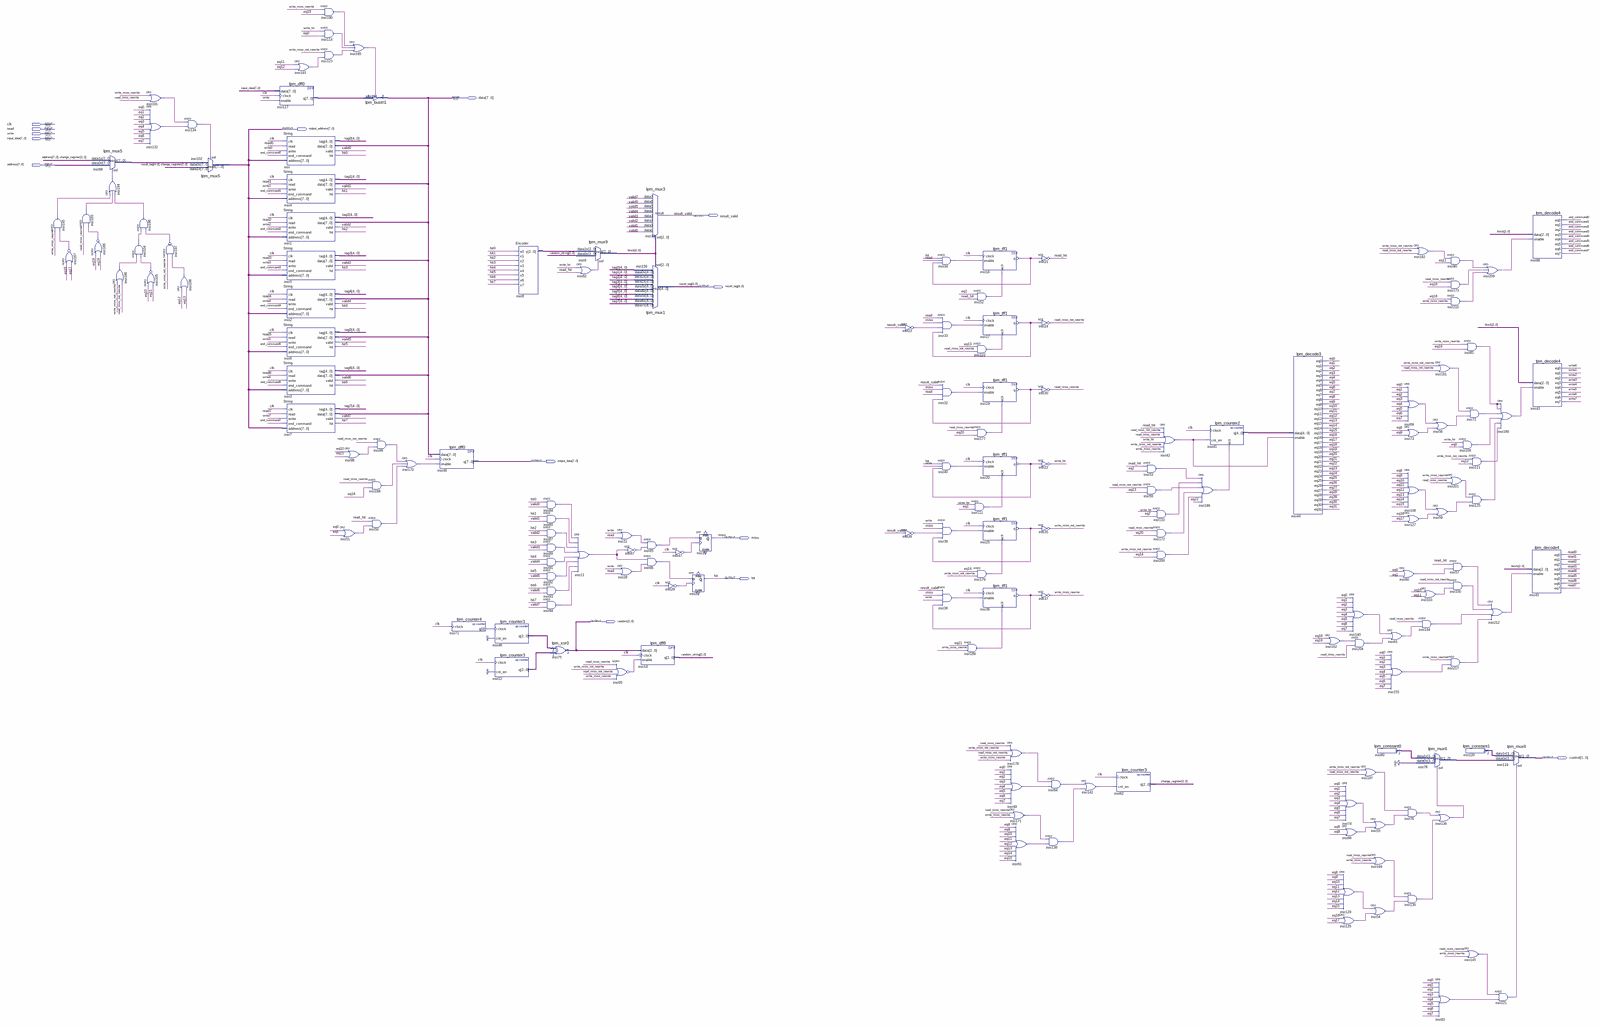
[diagram p0: schematic sheet, whole]
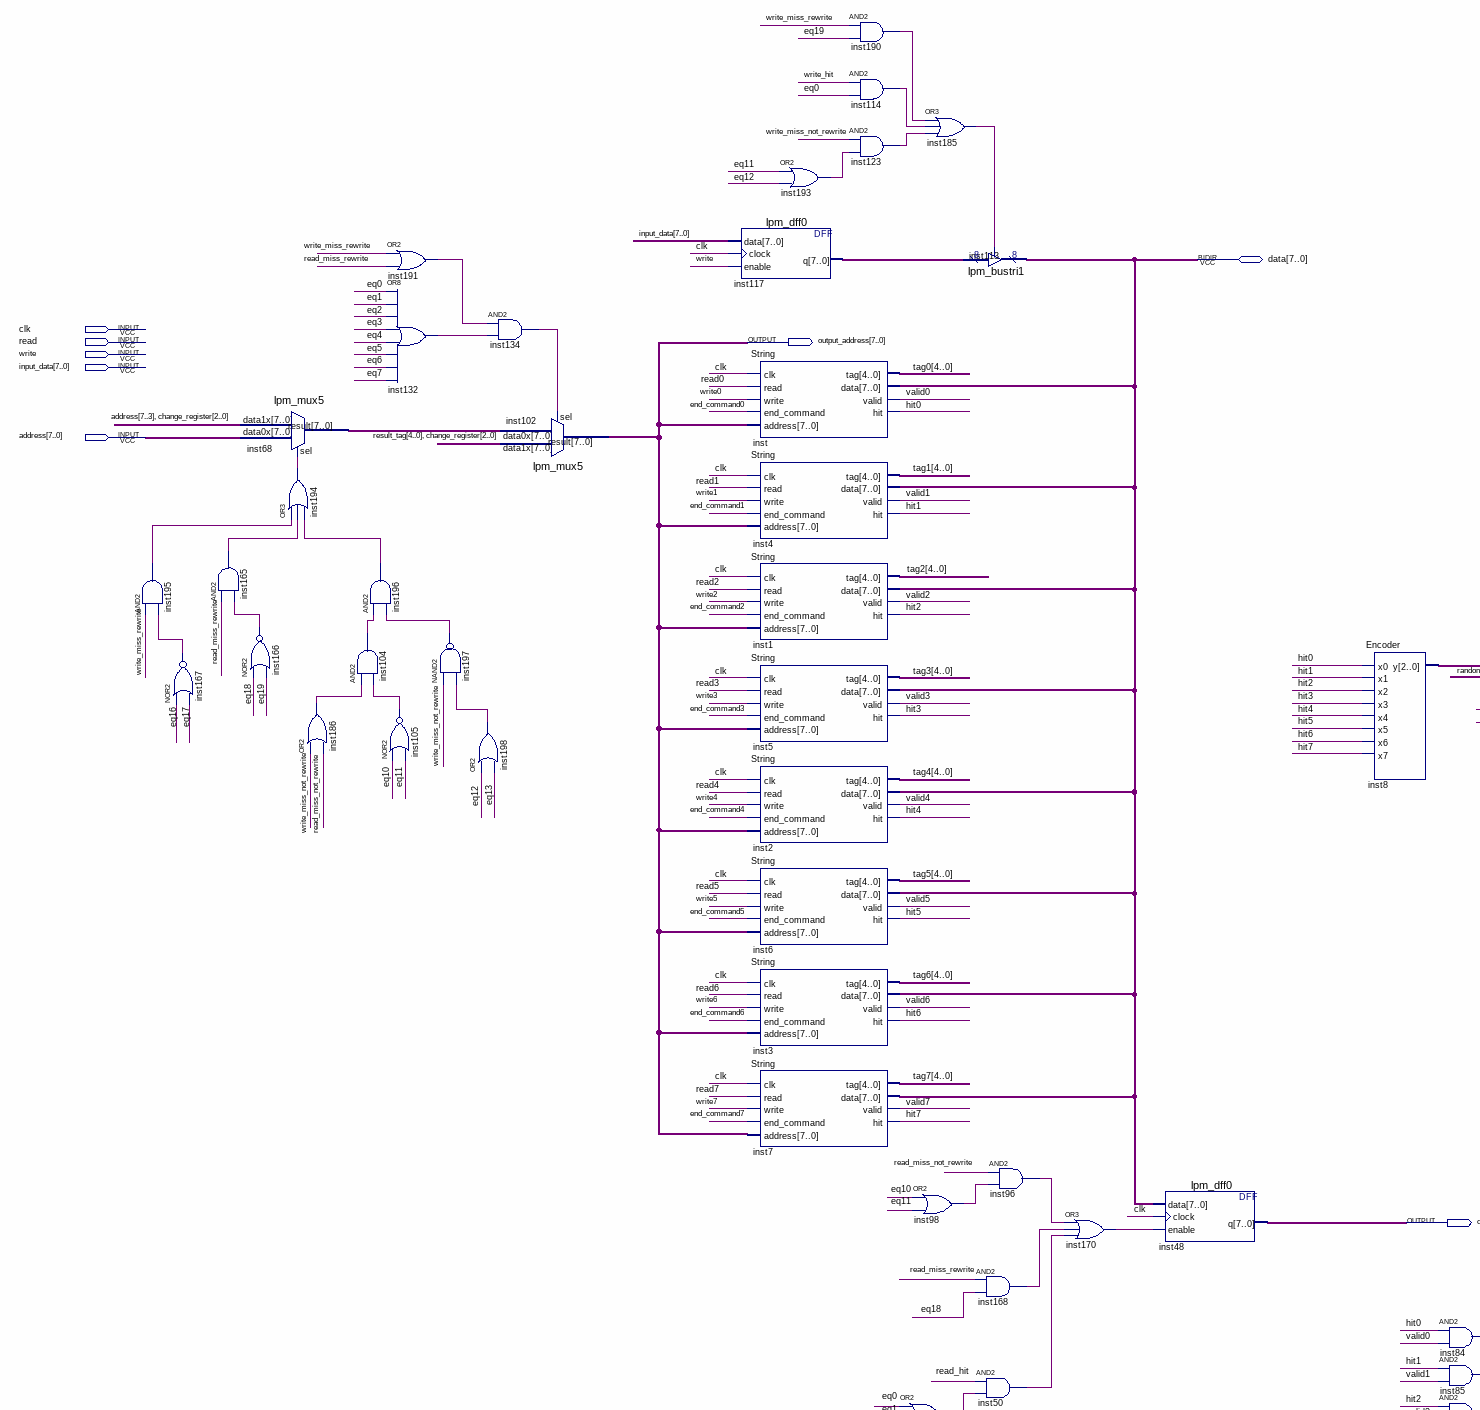
[diagram p1: schematic sheet, upper left part]
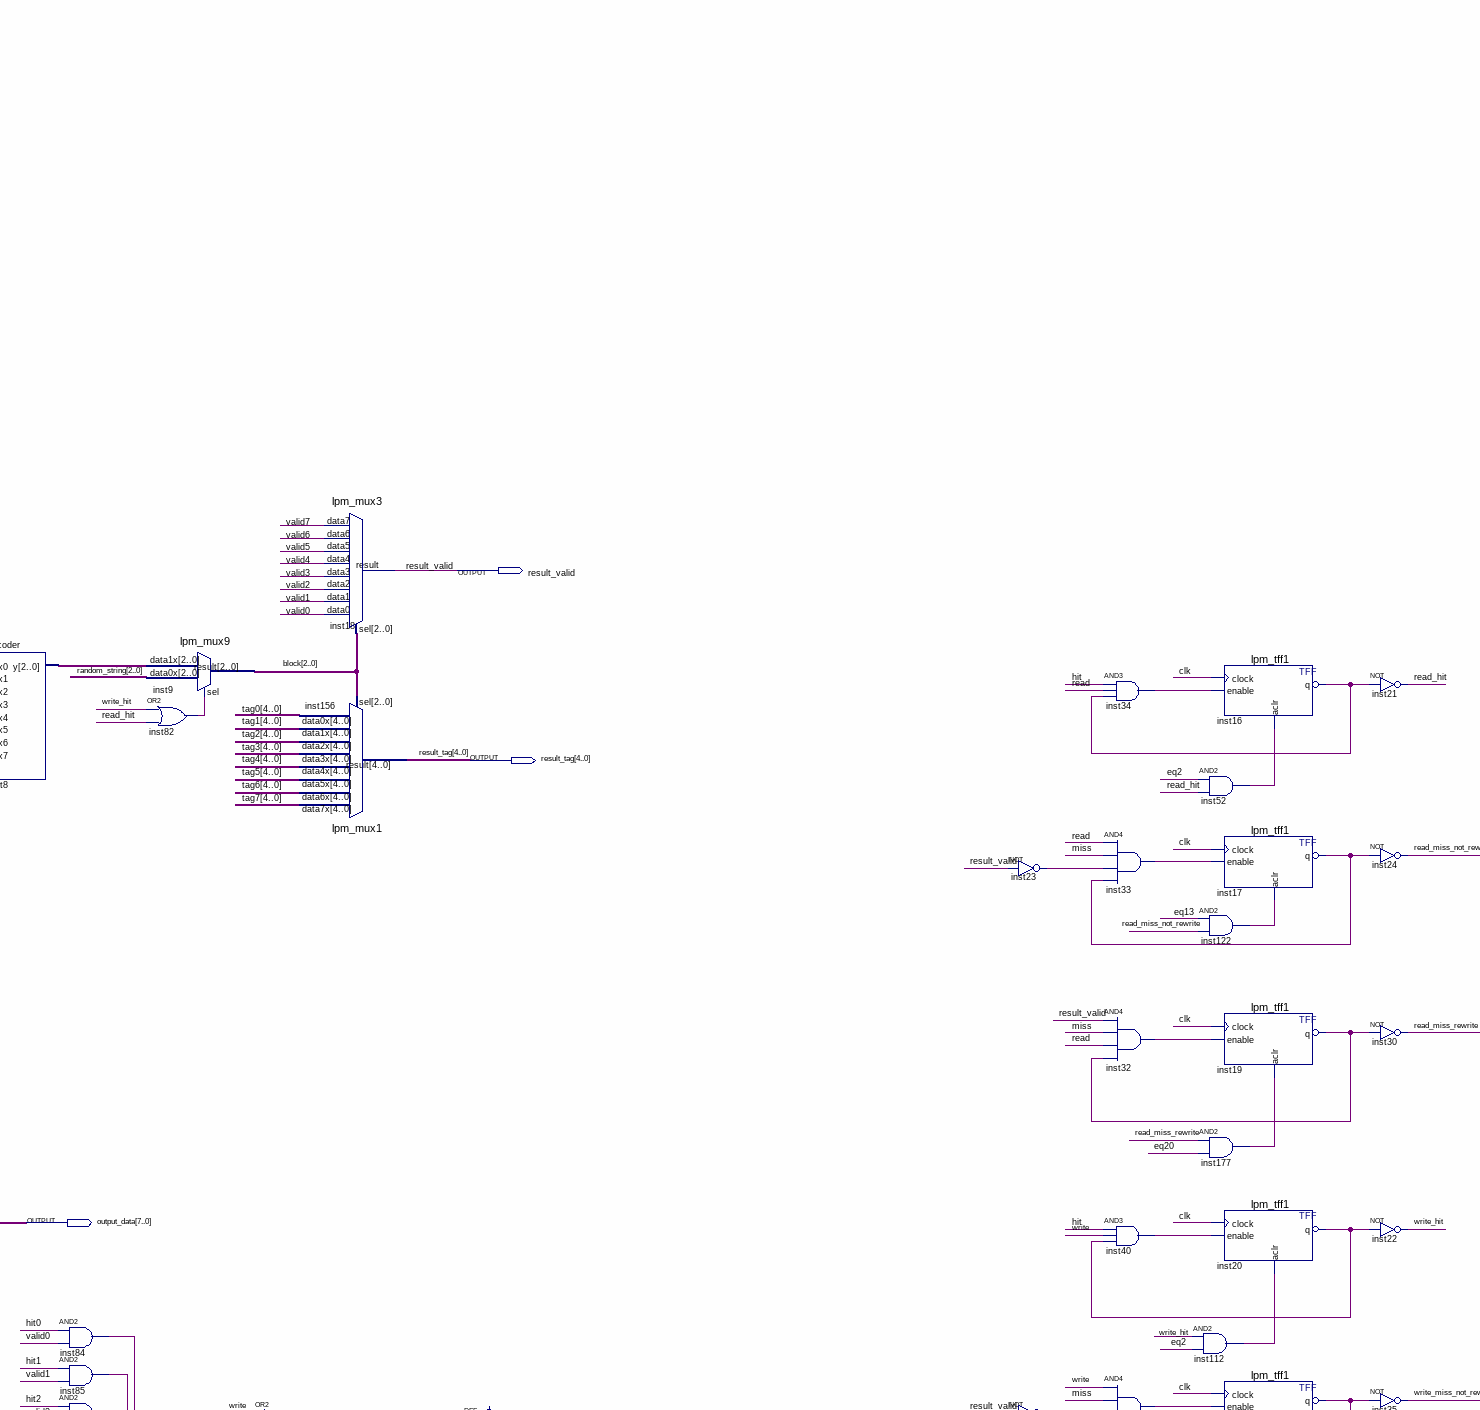
[diagram p2: schematic sheet, upper centre part]
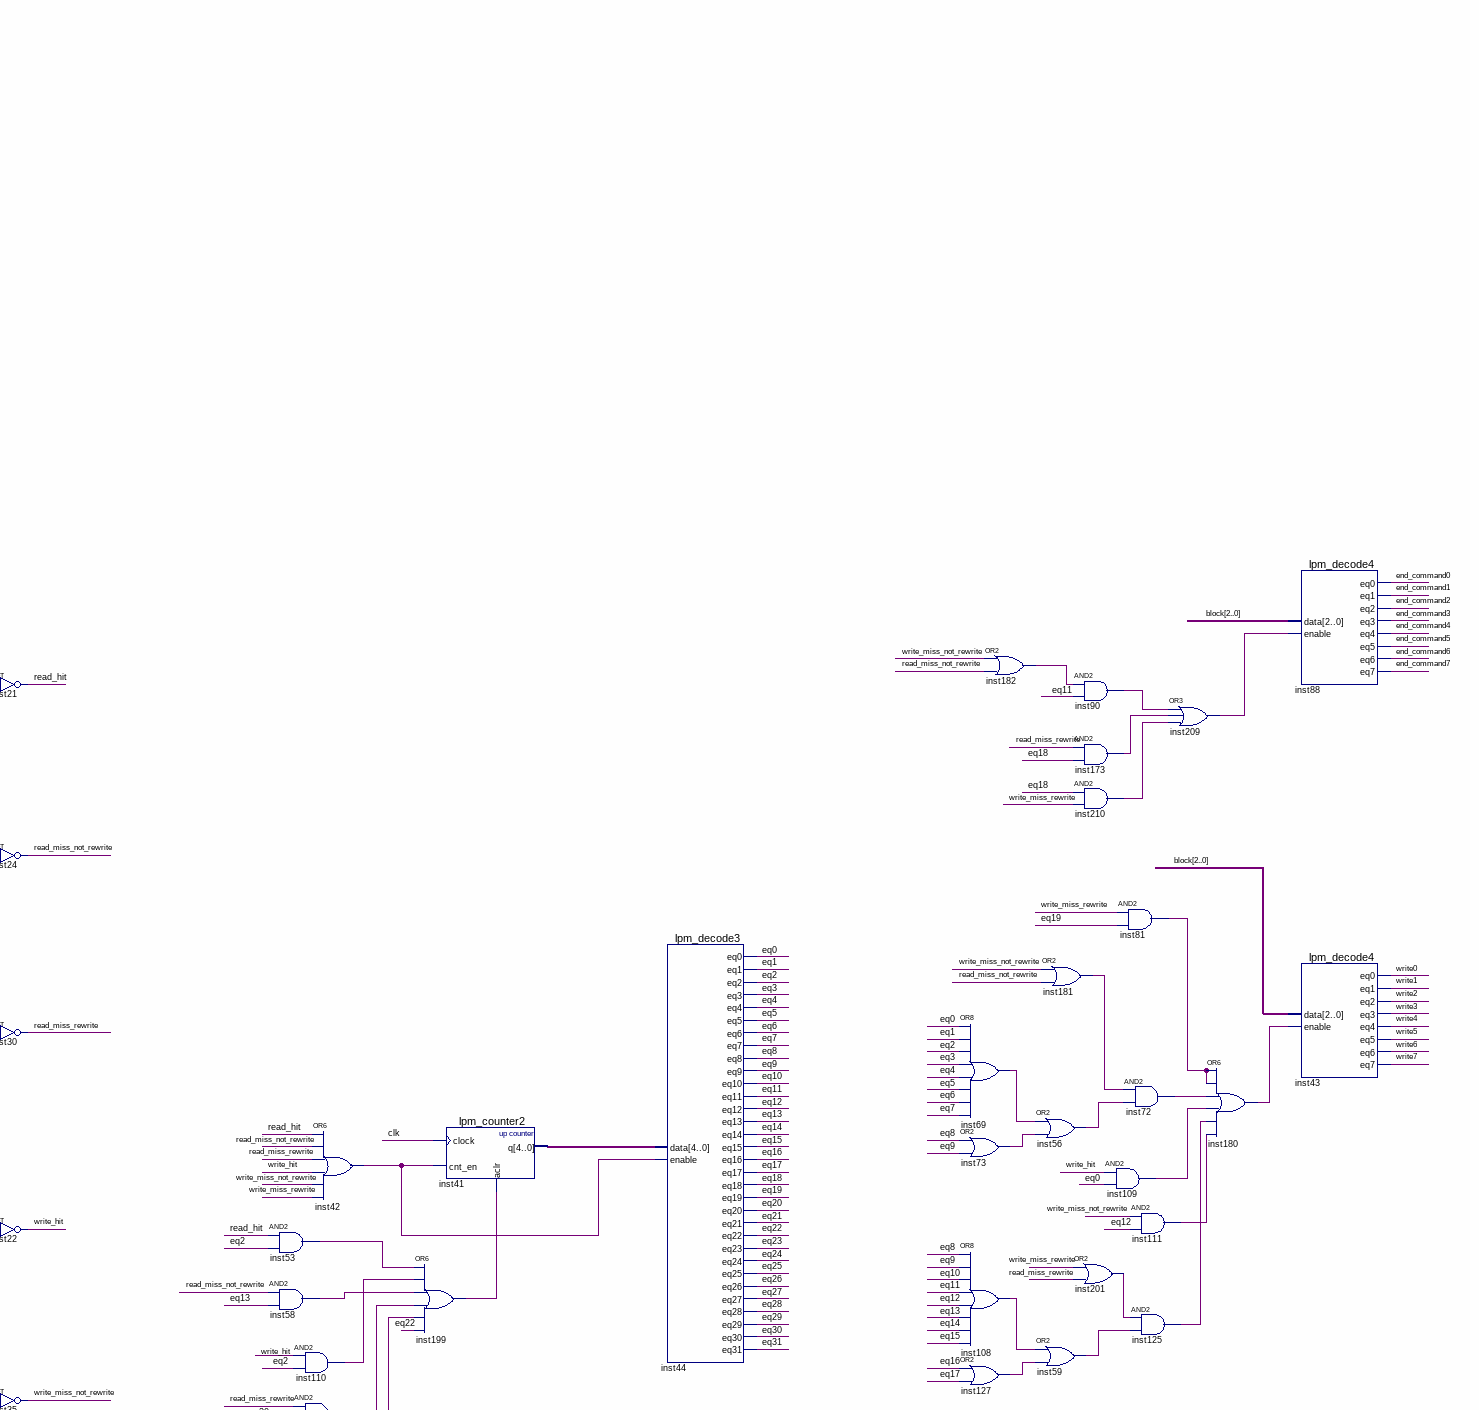
[diagram p3: schematic sheet, upper right part]
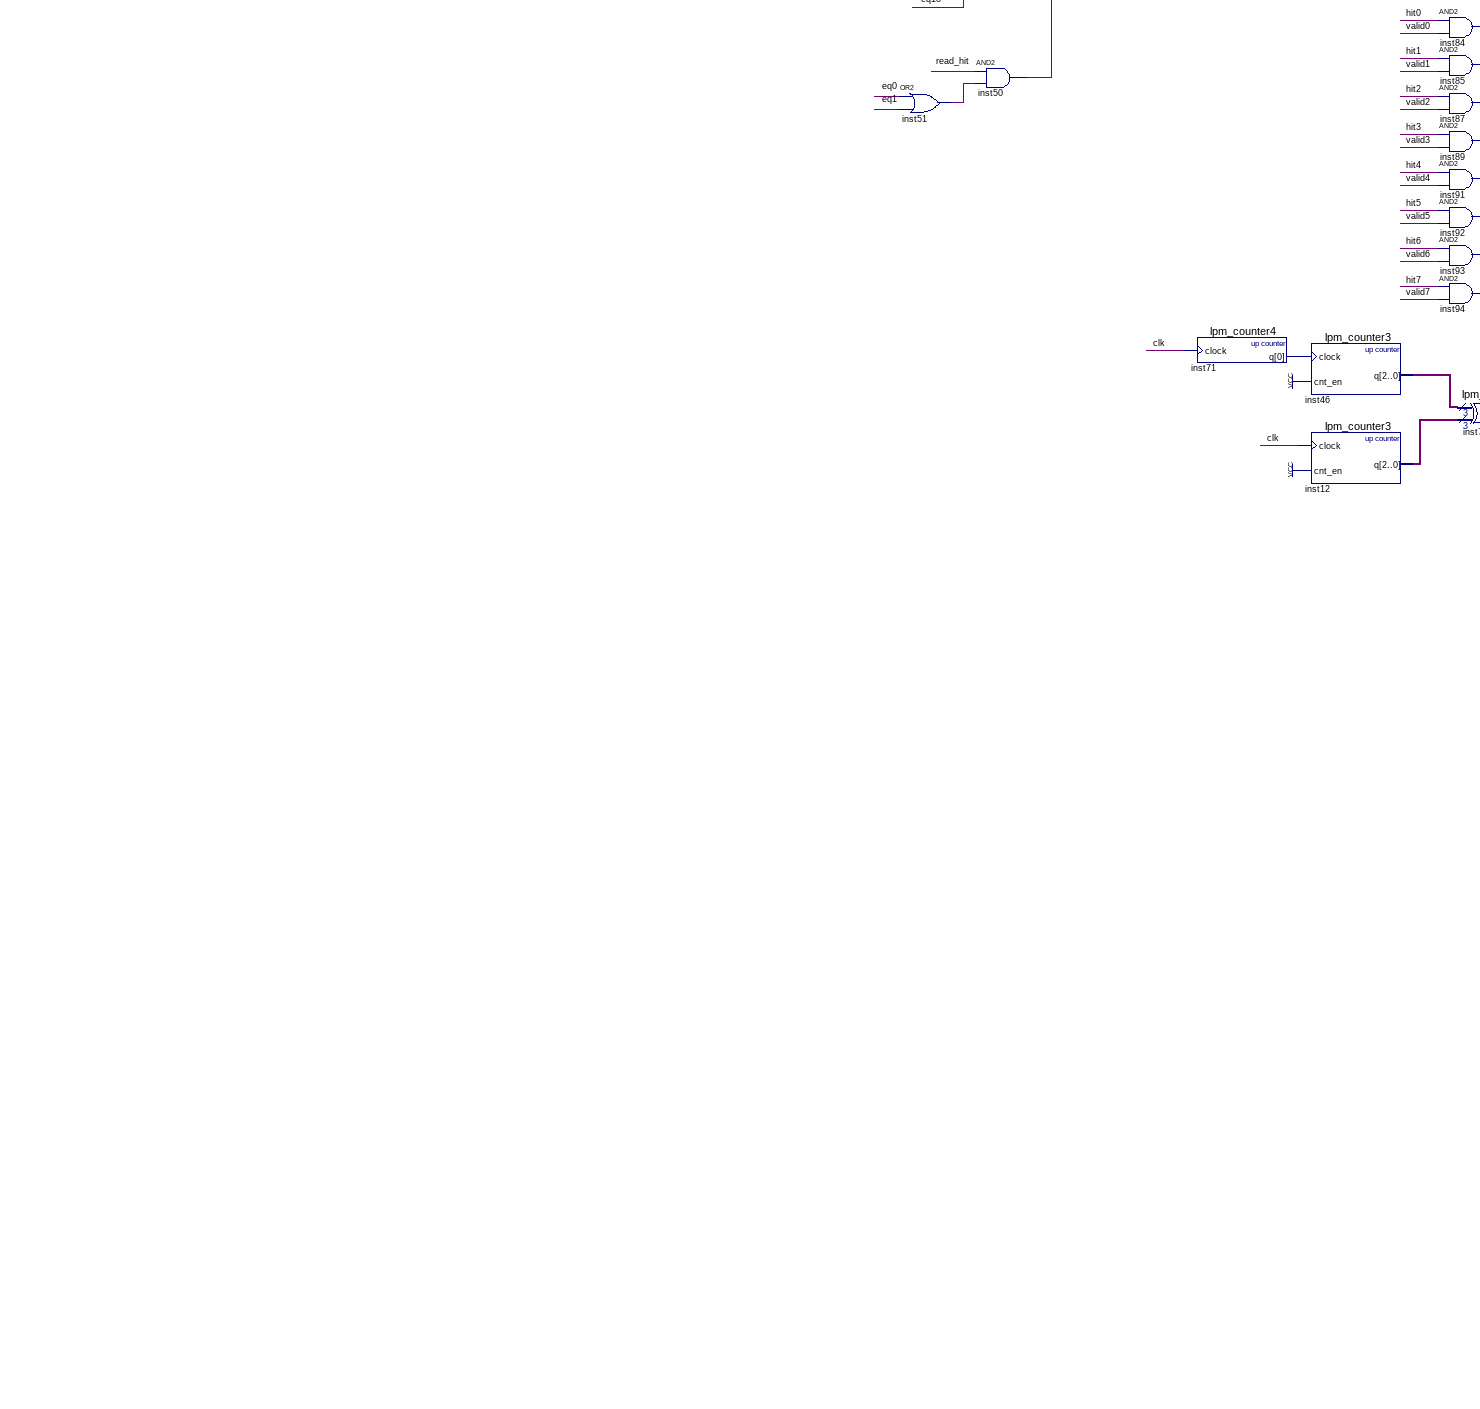
[diagram p4: schematic sheet, lower left part]
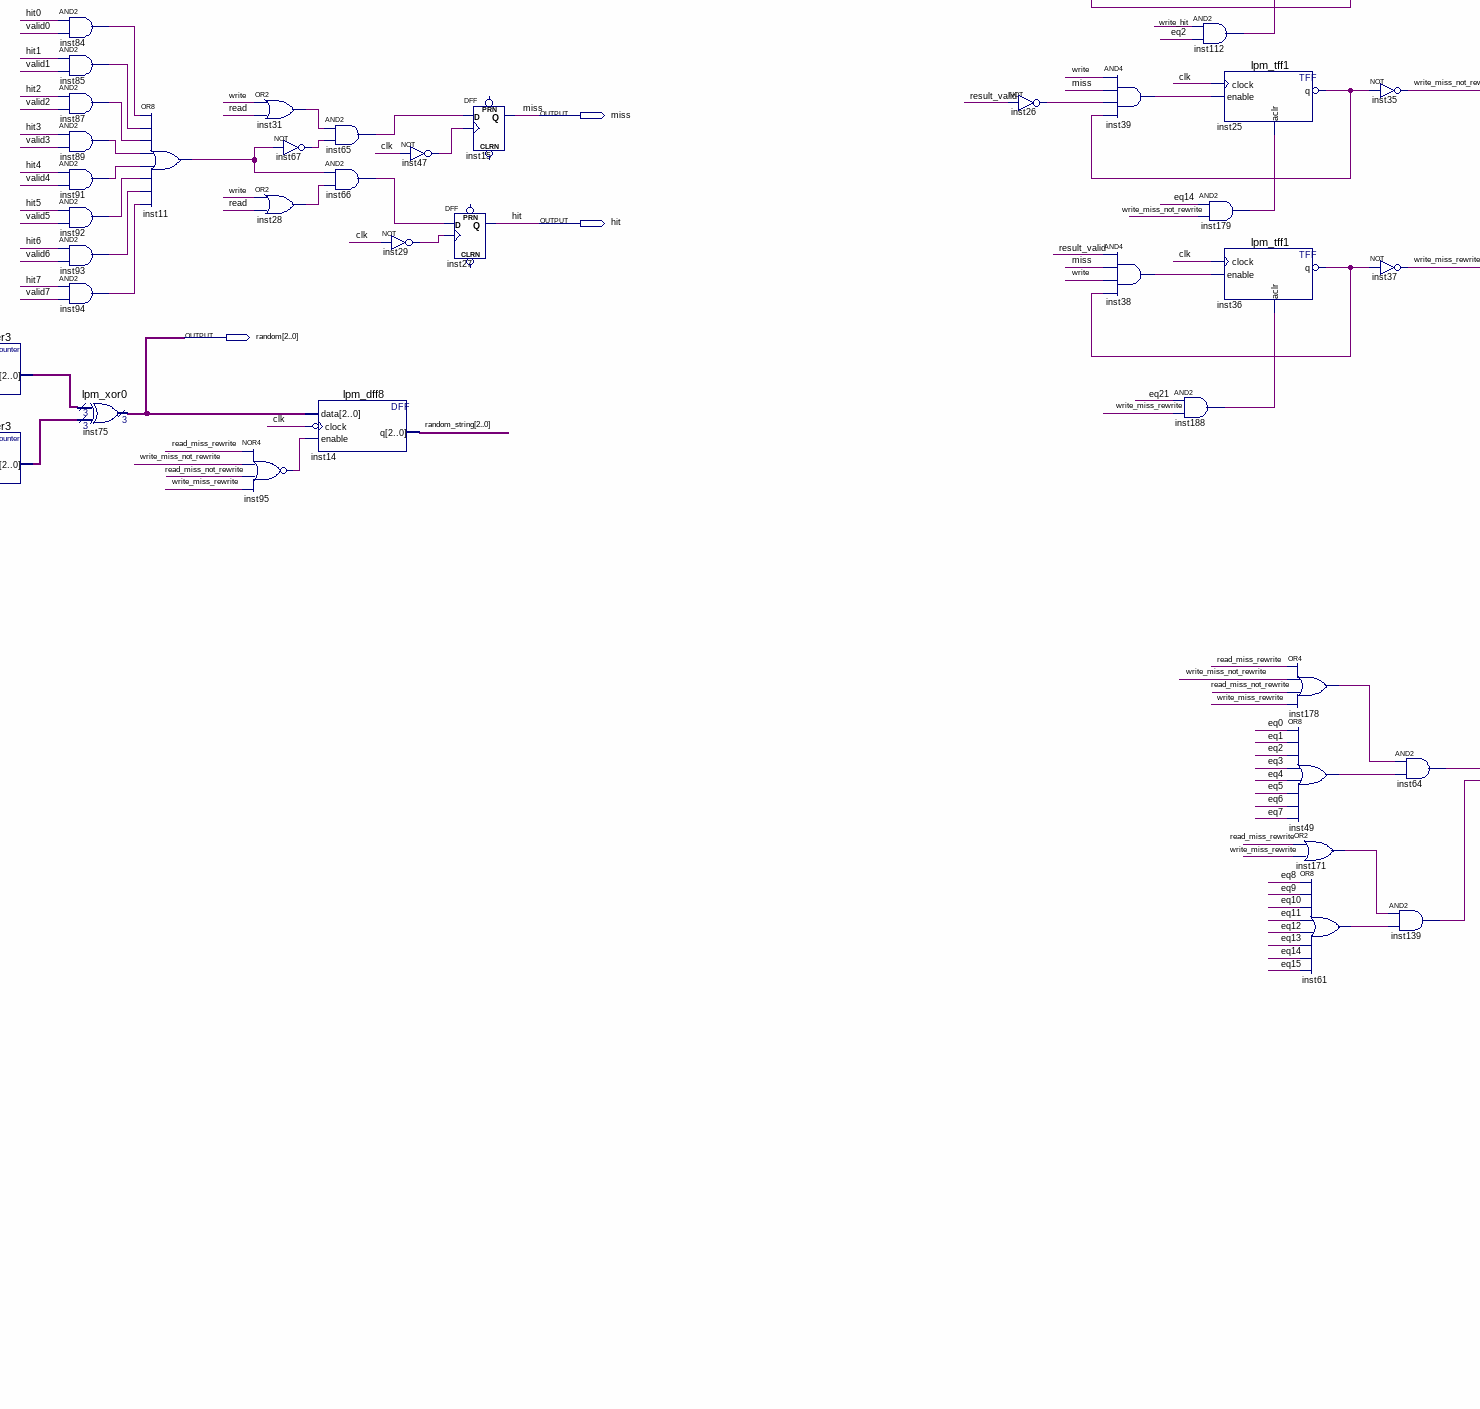
[diagram p5: schematic sheet, lower centre part]
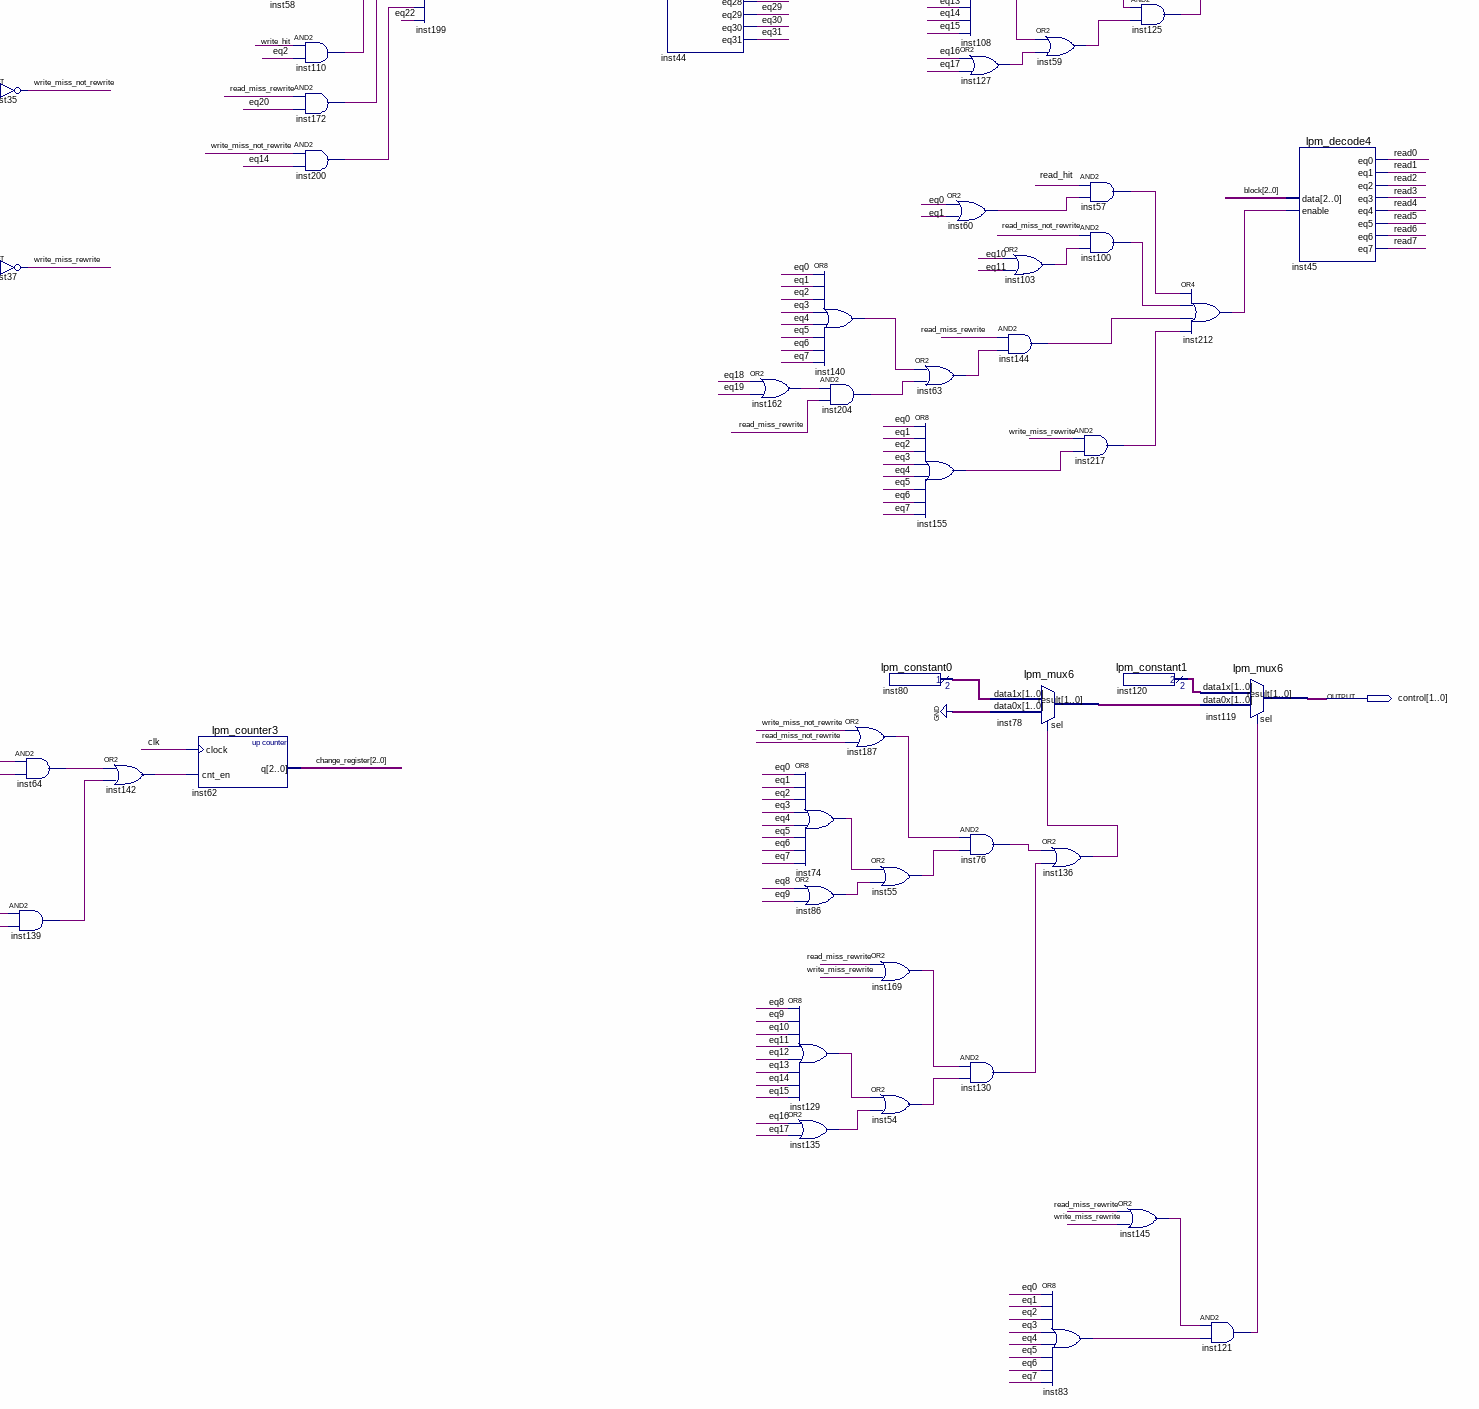
[diagram p6: schematic sheet, lower right part]
// Quartus schematic Cashe.bdf as structural Verilog: 162 symbols, 14 pins
module Cashe (
  input  clk,
  input  read,
  input  write,
  input  [7:0] input_data,
  input  [7:0] address,
  inout  [7:0] data,
  output [7:0] output_address,
  output result_valid,
  output [4:0] result_tag,
  output [7:0] output_data,
  output miss,
  output hit,
  output [2:0] random,
  output [1:0] control
);

  wire end_command0, end_command1, end_command2, end_command3, end_command4, end_command5, end_command6,
       end_command7, eq0, eq1, eq2, eq3, eq4, eq5, eq6, eq7, eq8, eq9, eq10, eq11, eq12, eq13, eq14, eq15,
       eq16, eq17, eq18, eq19, eq20, eq21, eq22, eq23, eq24, eq25, eq26, eq27, eq28, eq29, eq30, eq31, hit0,
       hit1, hit2, hit3, hit4, hit5, hit6, hit7, inst11_out, inst16_q, inst16_q_inverted_out, inst17_q,
       inst17_q_inverted_out, inst19_q, inst19_q_inverted_out, inst20_q, inst20_q_inverted_out, inst23_out,
       inst25_q, inst25_q_inverted_out, inst26_out, inst28_out, inst29_out, inst31_out, inst32_out,
       inst33_out, inst34_out, inst36_q, inst36_q_inverted_out, inst38_out, inst39_out, inst40_out,
       inst42_out, inst47_out, inst49_out, inst50_out, inst51_out, inst52_out, inst53_out, inst54_out,
       inst55_out, inst56_out, inst57_out, inst58_out, inst59_out, inst60_out, inst61_out, inst63_out,
       inst64_out, inst65_out, inst66_out, inst67_out, inst69_out, inst71_q, inst72_out, inst73_out,
       inst74_out, inst76_out, inst81_out, inst82_out, inst83_out, inst84_out, inst85_out, inst86_out,
       inst87_out, inst89_out, inst90_out, inst91_out, inst92_out, inst93_out, inst94_out, inst95_out,
       inst96_out, inst98_out, inst100_out, inst103_out, inst104_out, inst105_out, inst108_out, inst109_out,
       inst110_out, inst111_out, inst112_out, inst114_out, inst121_out, inst122_out, inst123_out,
       inst125_out, inst127_out, inst129_out, inst130_out, inst132_out, inst134_out, inst135_out,
       inst136_out, inst139_out, inst140_out, inst142_out, inst144_out, inst145_out, inst155_out,
       inst162_out, inst165_out, inst166_out, inst167_out, inst168_out, inst169_out, inst170_out,
       inst171_out, inst172_out, inst173_out, inst177_out, inst178_out, inst179_out, inst180_out,
       inst181_out, inst182_out, inst185_out, inst186_out, inst187_out, inst188_out, inst190_out,
       inst191_out, inst193_out, inst194_out, inst195_out, inst196_out, inst197_out, inst198_out,
       inst199_out, inst200_out, inst201_out, inst204_out, inst209_out, inst210_out, inst212_out,
       inst217_out, read0, read1, read2, read3, read4, read5, read6, read7, read_hit, read_miss_not_rewrite,
       read_miss_rewrite, valid0, valid1, valid2, valid3, valid4, valid5, valid6, valid7, write0, write1,
       write2, write3, write4, write5, write6, write7, write_hit, write_miss_not_rewrite, write_miss_rewrite;
  wire [1:0] inst78_result, inst80_result, inst120_result;
  wire [2:0] block, change_register, inst8_y, inst12_q, inst46_q, random_string;
  wire [4:0] inst41_q, tag0, tag1, tag2, tag3, tag4, tag5, tag6, tag7;
  wire [7:0] inst68_result, inst117_q;

  and inst195 (inst195_out, write_miss_rewrite, inst167_out);
  nor inst167 (inst167_out, eq16, eq17);
  lpm_mux5 inst68 (
    .data1x({address[7:3], change_register}), .data0x(address), .sel(inst194_out), .result(inst68_result));
  and inst165 (inst165_out, read_miss_rewrite, inst166_out);
  nor inst166 (inst166_out, eq18, eq19);
  or inst194 (inst194_out, inst195_out, inst165_out, inst196_out);
  or inst186 (inst186_out, write_miss_not_rewrite, read_miss_not_rewrite);
  and inst104 (inst104_out, inst186_out, inst105_out);
  or inst191 (inst191_out, write_miss_rewrite, read_miss_rewrite);
  or inst132 (inst132_out, eq0, eq1, eq2, eq3, eq4, eq5, eq6, eq7);
  and inst196 (inst196_out, inst104_out, inst197_out);
  nor inst105 (inst105_out, eq10, eq11);
  nand inst197 (inst197_out, write_miss_not_rewrite, inst198_out);
  and inst134 (inst134_out, inst191_out, inst132_out);
  lpm_mux5 inst102 (
    .data1x({result_tag, change_register}), .data0x(inst68_result), .sel(inst134_out), .result(output_address));
  or inst198 (inst198_out, eq12, eq13);
  lpm_dff0 inst117 (.data(input_data), .clock(clk), .enable(write), .q(inst117_q));
  String inst (
    .clk(clk), .read(read0), .write(write0), .end_command(end_command0), .address(output_address),
    .tag(tag0), .valid(valid0), .hit(hit0), .data(data));
  String inst4 (
    .clk(clk), .read(read1), .write(write1), .end_command(end_command1), .address(output_address),
    .tag(tag1), .valid(valid1), .hit(hit1), .data(data));
  String inst1 (
    .clk(clk), .read(read2), .write(write2), .end_command(end_command2), .address(output_address),
    .tag(tag2), .valid(valid2), .hit(hit2), .data(data));
  String inst5 (
    .clk(clk), .read(read3), .write(write3), .end_command(end_command3), .address(output_address),
    .tag(tag3), .valid(valid3), .hit(hit3), .data(data));
  String inst2 (
    .clk(clk), .read(read4), .write(write4), .end_command(end_command4), .address(output_address),
    .tag(tag4), .valid(valid4), .hit(hit4), .data(data));
  String inst6 (
    .clk(clk), .read(read5), .write(write5), .end_command(end_command5), .address(output_address),
    .tag(tag5), .valid(valid5), .hit(hit5), .data(data));
  String inst3 (
    .clk(clk), .read(read6), .write(write6), .end_command(end_command6), .address(output_address),
    .tag(tag6), .valid(valid6), .hit(hit6), .data(data));
  String inst7 (
    .clk(clk), .read(read7), .write(write7), .end_command(end_command7), .address(output_address),
    .tag(tag7), .valid(valid7), .hit(hit7), .data(data));
  or inst193 (inst193_out, eq11, eq12);
  and inst190 (inst190_out, write_miss_rewrite, eq19);
  and inst114 (inst114_out, write_hit, eq0);
  and inst123 (inst123_out, write_miss_not_rewrite, inst193_out);
  or inst51 (inst51_out, eq0, eq1);
  or inst185 (inst185_out, inst190_out, inst114_out, inst123_out);
  or inst98 (inst98_out, eq10, eq11);
  lpm_bustri1 inst113 (.enabledt(inst185_out), .data(inst117_q), .tridata(data));
  and inst96 (inst96_out, read_miss_not_rewrite, inst98_out);
  and inst168 (inst168_out, read_miss_rewrite, eq18);
  and inst50 (inst50_out, read_hit, inst51_out);
  or inst170 (inst170_out, inst96_out, inst168_out, inst50_out);
  lpm_dff0 inst48 (.data(data), .clock(clk), .enable(inst170_out), .q(output_data));
  lpm_counter4 inst71 (.clock(clk), .q(inst71_q));
  lpm_counter3 inst46 (.clock(inst71_q), .cnt_en(1'b1), .q(inst46_q));
  lpm_counter3 inst12 (.clock(clk), .cnt_en(1'b1), .q(inst12_q));
  Encoder inst8 (.x0(hit0), .x1(hit1), .x2(hit2), .x3(hit3), .x4(hit4), .x5(hit5), .x6(hit6), .x7(hit7), .y(inst8_y));
  and inst84 (inst84_out, hit0, valid0);
  and inst85 (inst85_out, hit1, valid1);
  and inst87 (inst87_out, hit2, valid2);
  and inst89 (inst89_out, hit3, valid3);
  and inst91 (inst91_out, hit4, valid4);
  and inst92 (inst92_out, hit5, valid5);
  and inst93 (inst93_out, hit6, valid6);
  and inst94 (inst94_out, hit7, valid7);
  lpm_xor0 inst75 (.data0x(inst46_q), .data1x(inst12_q), .result(random));
  lpm_mux9 inst9 (.data1x(inst8_y), .data0x(random_string), .sel(inst82_out), .result(block));
  or inst82 (inst82_out, write_hit, read_hit);
  or inst11 (inst11_out, inst84_out, inst85_out, inst87_out, inst89_out, inst91_out, inst92_out, inst93_out, inst94_out);
  or inst31 (inst31_out, write, read);
  not inst67 (inst67_out, inst11_out);
  or inst28 (inst28_out, write, read);
  nor inst95 (inst95_out, read_miss_rewrite, write_miss_not_rewrite, read_miss_not_rewrite, write_miss_rewrite);
  lpm_mux3 inst18 (
    .data7(valid7), .data6(valid6), .data5(valid5), .data4(valid4), .data3(valid3), .data2(valid2),
    .data1(valid1), .data0(valid0), .sel(block), .result(result_valid));
  lpm_mux1 inst156 (
    .data7x(tag7), .data6x(tag6), .data5x(tag5), .data4x(tag4), .data3x(tag3), .data2x(tag2), .data1x(tag1),
    .data0x(tag0), .sel(block), .result(result_tag));
  and inst65 (inst65_out, inst31_out, inst67_out);
  and inst66 (inst66_out, inst11_out, inst28_out);
  lpm_dff8 inst14 (.data(random), .clock(~clk), .enable(inst95_out), .q(random_string));
  not inst29 (inst29_out, clk);
  not inst47 (inst47_out, clk);
  DFF inst15 (.CLK(inst47_out), .D(inst65_out), .Q(miss));  // open: CLRN, PRN
  DFF inst27 (.CLK(inst29_out), .D(inst66_out), .Q(hit));  // open: CLRN, PRN
  not inst23 (inst23_out, result_valid);
  not inst26 (inst26_out, result_valid);
  and inst34 (inst34_out, hit, read, inst16_q_inverted_out);
  and inst33 (inst33_out, read, miss, inst23_out, inst17_q_inverted_out);
  and inst32 (inst32_out, result_valid, miss, read, inst19_q_inverted_out);
  and inst40 (inst40_out, hit, write, inst20_q_inverted_out);
  and inst39 (inst39_out, write, miss, inst26_out, inst25_q_inverted_out);
  and inst38 (inst38_out, result_valid, miss, write, inst36_q_inverted_out);
  and inst52 (inst52_out, eq2, read_hit);
  and inst122 (inst122_out, eq13, read_miss_not_rewrite);
  and inst177 (inst177_out, read_miss_rewrite, eq20);
  and inst112 (inst112_out, write_hit, eq2);
  and inst179 (inst179_out, eq14, write_miss_not_rewrite);
  and inst188 (inst188_out, eq21, write_miss_rewrite);
  lpm_tff1 inst16 (.clock(clk), .enable(inst34_out), .aclr(inst52_out), .q(inst16_q));
  not inst16_q_inverted (inst16_q_inverted_out, inst16_q);
  lpm_tff1 inst17 (.clock(clk), .enable(inst33_out), .aclr(inst122_out), .q(inst17_q));
  not inst17_q_inverted (inst17_q_inverted_out, inst17_q);
  lpm_tff1 inst19 (.clock(clk), .enable(inst32_out), .aclr(inst177_out), .q(inst19_q));
  not inst19_q_inverted (inst19_q_inverted_out, inst19_q);
  lpm_tff1 inst20 (.clock(clk), .enable(inst40_out), .aclr(inst112_out), .q(inst20_q));
  not inst20_q_inverted (inst20_q_inverted_out, inst20_q);
  lpm_tff1 inst25 (.clock(clk), .enable(inst39_out), .aclr(inst179_out), .q(inst25_q));
  not inst25_q_inverted (inst25_q_inverted_out, inst25_q);
  lpm_tff1 inst36 (.clock(clk), .enable(inst38_out), .aclr(inst188_out), .q(inst36_q));
  not inst36_q_inverted (inst36_q_inverted_out, inst36_q);
  or inst178 (inst178_out, read_miss_rewrite, write_miss_not_rewrite, read_miss_not_rewrite, write_miss_rewrite);
  or inst49 (inst49_out, eq0, eq1, eq2, eq3, eq4, eq5, eq6, eq7);
  or inst171 (inst171_out, read_miss_rewrite, write_miss_rewrite);
  or inst61 (inst61_out, eq8, eq9, eq10, eq11, eq12, eq13, eq14, eq15);
  not inst21 (read_hit, inst16_q_inverted_out);
  not inst24 (read_miss_not_rewrite, inst17_q_inverted_out);
  not inst30 (read_miss_rewrite, inst19_q_inverted_out);
  not inst22 (write_hit, inst20_q_inverted_out);
  not inst35 (write_miss_not_rewrite, inst25_q_inverted_out);
  not inst37 (write_miss_rewrite, inst36_q_inverted_out);
  and inst64 (inst64_out, inst178_out, inst49_out);
  and inst139 (inst139_out, inst171_out, inst61_out);
  or inst142 (inst142_out, inst64_out, inst139_out);
  lpm_counter3 inst62 (.clock(clk), .cnt_en(inst142_out), .q(change_register));
  and inst53 (inst53_out, read_hit, eq2);
  and inst58 (inst58_out, read_miss_not_rewrite, eq13);
  or inst42 (inst42_out, read_hit, read_miss_not_rewrite, read_miss_rewrite, write_hit, write_miss_not_rewrite, write_miss_rewrite);
  and inst110 (inst110_out, write_hit, eq2);
  and inst172 (inst172_out, read_miss_rewrite, eq20);
  and inst200 (inst200_out, write_miss_not_rewrite, eq14);
  or inst199 (inst199_out, inst53_out, inst110_out, inst58_out, inst172_out, inst200_out, eq22);
  lpm_counter2 inst41 (.clock(clk), .cnt_en(inst42_out), .aclr(inst199_out), .q(inst41_q));
  lpm_decode3 inst44 (
    .data(inst41_q), .enable(inst42_out), .eq0(eq0), .eq1(eq1), .eq2(eq2), .eq3(eq3), .eq4(eq4), .eq5(eq5),
    .eq6(eq6), .eq7(eq7), .eq8(eq8), .eq9(eq9), .eq10(eq10), .eq11(eq11), .eq12(eq12), .eq13(eq13),
    .eq14(eq14), .eq15(eq15), .eq16(eq16), .eq17(eq17), .eq18(eq18), .eq19(eq19), .eq20(eq20), .eq21(eq21),
    .eq22(eq22), .eq23(eq23), .eq24(eq24), .eq25(eq25), .eq26(eq26), .eq27(eq27), .eq28(eq28), .eq29(eq29),
    .eq30(eq30), .eq31(eq31));
  or inst162 (inst162_out, eq18, eq19);
  or inst140 (inst140_out, eq0, eq1, eq2, eq3, eq4, eq5, eq6, eq7);
  and inst204 (inst204_out, inst162_out, read_miss_rewrite);
  or inst74 (inst74_out, eq0, eq1, eq2, eq3, eq4, eq5, eq6, eq7);
  or inst86 (inst86_out, eq8, eq9);
  or inst129 (inst129_out, eq8, eq9, eq10, eq11, eq12, eq13, eq14, eq15);
  or inst135 (inst135_out, eq16, eq17);
  lpm_constant0 inst80 (.result(inst80_result));
  or inst187 (inst187_out, write_miss_not_rewrite, read_miss_not_rewrite);
  or inst55 (inst55_out, inst74_out, inst86_out);
  or inst169 (inst169_out, read_miss_rewrite, write_miss_rewrite);
  or inst54 (inst54_out, inst129_out, inst135_out);
  or inst63 (inst63_out, inst140_out, inst204_out);
  or inst155 (inst155_out, eq0, eq1, eq2, eq3, eq4, eq5, eq6, eq7);
  or inst182 (inst182_out, write_miss_not_rewrite, read_miss_not_rewrite);
  or inst69 (inst69_out, eq0, eq1, eq2, eq3, eq4, eq5, eq6, eq7);
  or inst73 (inst73_out, eq8, eq9);
  or inst108 (inst108_out, eq8, eq9, eq10, eq11, eq12, eq13, eq14, eq15);
  or inst127 (inst127_out, eq16, eq17);
  or inst60 (inst60_out, eq0, eq1);
  and inst76 (inst76_out, inst187_out, inst55_out);
  and inst130 (inst130_out, inst169_out, inst54_out);
  or inst56 (inst56_out, inst69_out, inst73_out);
  or inst59 (inst59_out, inst108_out, inst127_out);
  or inst103 (inst103_out, eq10, eq11);
  and inst144 (inst144_out, read_miss_rewrite, inst63_out);
  lpm_mux6 inst78 (.data1x(inst80_result), .data0x(2'b00), .sel(inst136_out), .result(inst78_result));
  and inst90 (inst90_out, inst182_out, eq11);
  and inst173 (inst173_out, read_miss_rewrite, eq18);
  and inst210 (inst210_out, eq18, write_miss_rewrite);
  or inst181 (inst181_out, write_miss_not_rewrite, read_miss_not_rewrite);
  or inst201 (inst201_out, write_miss_rewrite, read_miss_rewrite);
  and inst57 (inst57_out, read_hit, inst60_out);
  and inst100 (inst100_out, read_miss_not_rewrite, inst103_out);
  and inst217 (inst217_out, write_miss_rewrite, inst155_out);
  or inst136 (inst136_out, inst76_out, inst130_out);
  or inst83 (inst83_out, eq0, eq1, eq2, eq3, eq4, eq5, eq6, eq7);
  and inst81 (inst81_out, write_miss_rewrite, eq19);
  and inst72 (inst72_out, inst181_out, inst56_out);
  and inst109 (inst109_out, write_hit, eq0);
  and inst111 (inst111_out, write_miss_not_rewrite, eq12);
  and inst125 (inst125_out, inst201_out, inst59_out);
  lpm_constant1 inst120 (.result(inst120_result));
  or inst145 (inst145_out, read_miss_rewrite, write_miss_rewrite);
  or inst209 (inst209_out, inst90_out, inst173_out, inst210_out);
  or inst212 (inst212_out, inst57_out, inst100_out, inst144_out, inst217_out);
  or inst180 (inst180_out, inst81_out, inst81_out, inst72_out, inst109_out, inst125_out, inst111_out);
  lpm_mux6 inst119 (.data1x(inst120_result), .data0x(inst78_result), .sel(inst121_out), .result(control));
  and inst121 (inst121_out, inst145_out, inst83_out);
  lpm_decode4 inst88 (
    .data(block), .enable(inst209_out), .eq0(end_command0), .eq1(end_command1), .eq2(end_command2),
    .eq3(end_command3), .eq4(end_command4), .eq5(end_command5), .eq6(end_command6), .eq7(end_command7));
  lpm_decode4 inst43 (
    .data(block), .enable(inst180_out), .eq0(write0), .eq1(write1), .eq2(write2), .eq3(write3), .eq4(write4),
    .eq5(write5), .eq6(write6), .eq7(write7));
  lpm_decode4 inst45 (
    .data(block), .enable(inst212_out), .eq0(read0), .eq1(read1), .eq2(read2), .eq3(read3), .eq4(read4),
    .eq5(read5), .eq6(read6), .eq7(read7));
endmodule
